# Altium schematic sheet Pin_input.SchDoc
size A4; SheetNumber: 3; SheetTotal: 3
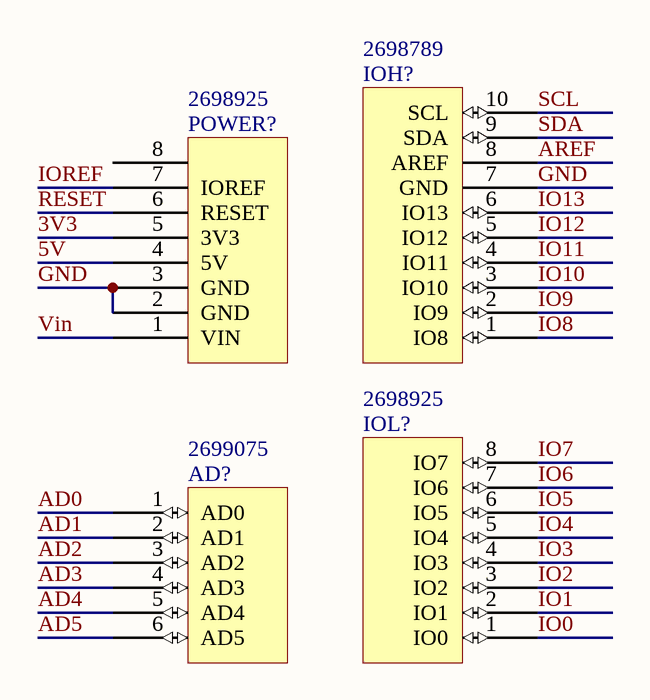
[diagram p0: Pin_input.SchDoc]

## Parts
AD?  Supplier Part Number 4: 2699075  [Header 6x1 8.5mm]  (hidden comment: AD)
IOH?  Supplier Part Number 3: 2698789  [Header 10x1 8.5mm]  (hidden comment: IOH)
IOL?  Supplier Part Number 4: 2698925  [Header 8x1 8.5mm]  (hidden comment: IOL)
POWER?  Supplier Part Number 4: 2698925  [Header 8x1 8.5mm]  (hidden comment: POWER_UNO)

## Nets
3V3: POWER?.5(3V3)
5V: POWER?.4(5V)
AD0: AD?.1(AD0)
AD1: AD?.2(AD1)
AD2: AD?.3(AD2)
AD3: AD?.4(AD3)
AD4: AD?.5(AD4)
AD5: AD?.6(AD5)
AREF: IOH?.8(AREF)
GND: IOH?.7(GND) POWER?.2(GND) POWER?.3(GND)
IO0: IOL?.1(IO0)
IO1: IOL?.2(IO1)
IO2: IOL?.3(IO2)
IO3: IOL?.4(IO3)
IO4: IOL?.5(IO4)
IO5: IOL?.6(IO5)
IO6: IOL?.7(IO6)
IO7: IOL?.8(IO7)
IO8: IOH?.1(IO8)
IO9: IOH?.2(IO9)
IO10: IOH?.3(IO10)
IO11: IOH?.4(IO11)
IO12: IOH?.5(IO12)
IO13: IOH?.6(IO13)
IOREF: POWER?.7(IOREF)
RESET: POWER?.6(RESET)
SCL: IOH?.10(SCL)
SDA: IOH?.9(SDA)
Vin: POWER?.1(VIN)

Not connected (* = marked no-connect by the designer): POWER? 8

## Library data of the parts
AD? = AD: Supplier 1: Arrow; Supplier Part Number 1: 2699089; Supplier 2: Digi-Key; Supplier Part Number 2: SAM1198-06-ND; Supplier 3: Arrow; Supplier Part Number 3: 2699088; Supplier 4: Arrow
IOH? = IOH: Supplier 1: Arrow; Supplier Part Number 1: 2698803S4475693N1004; Supplier 2: Digi-Key; Supplier Part Number 2: SAM1198-10-ND; Supplier 3: Arrow
IOL? = IOL: Supplier 1: Digi-Key; Supplier Part Number 1: SAM1198-08-ND; Supplier 2: Arrow; Supplier Part Number 2: 2698939; Supplier 3: Arrow; Supplier Part Number 3: 2698940; Supplier 4: Arrow
POWER? = POWER_UNO: Supplier 1: Digi-Key; Supplier Part Number 1: SAM1198-08-ND; Supplier 2: Arrow; Supplier Part Number 2: 2698939; Supplier 3: Arrow; Supplier Part Number 3: 2698940; Supplier 4: Arrow